# EAGLE design SwitchDemoESeries (EAGLE 9.4.0)
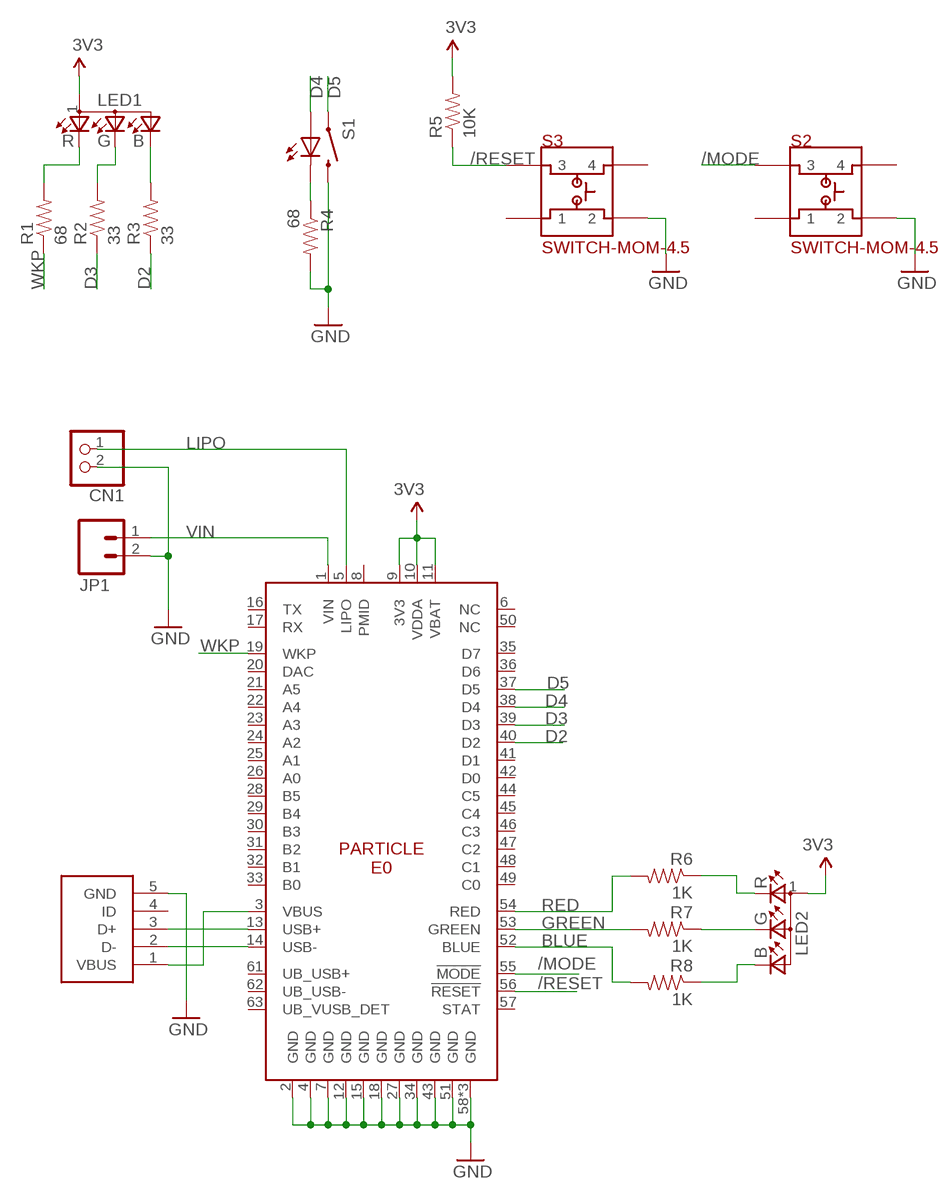
[diagram p0: schematic, sheet 1]

## Parts
CN1  JST_2PIN-THM  [JST-PH-2-THM]
JP1  M02PTH  [1X02]
LED1  LED-RGB-CREE-SMD  [LED-RGB-CREE-SMD]
LED2  LED-RGB-CREE-SMD  [LED-RGB-CREE-SMD]
R1  68  RES-68-0603.DEV  [0603-RES]
R2  33  RES-33-0603.DEV  [0603-RES]
R3  33  RES-33-0603.DEV  [0603-RES]
R4  68  RES-68-0603.DEV  [0603-RES]
R5  10K  RES-10K-06030603  [0603-RES]
R6  1K  RES-1K-0603  [0603-RES]
R7  1K  RES-1K-0603  [0603-RES]
R8  1K  RES-1K-0603  [0603-RES]
S1  SWITCH-MOMENTARY-LEDPTH  [TACTILE-PTH-LED-12MM]
S2  SWITCH-MOM-4.5  [SWITCH-MOM-4.5]
S3  SWITCH-MOM-4.5  [SWITCH-MOM-4.5]
U1  E0_V005  [E0]
U$3  USB-MICRO-B-SOCKET-AMPHENOL  [USB-B-SMT-AMPHENOL]

## Nets
3V3: LED1.1(A) LED2.1(A) R5.2 U1.9(3V3) U1.10(VDDA) U1.11(VBAT)
/MODE: S2.3 U1.55(!MODE)
/RESET: R5.1 S3.3 U1.56(!RESET)
BLED: LED1.2(B) R3.2
BLUE: R8.2 U1.52(BLUE)
D2: R3.1 U1.40(D2)
D3: R2.1 U1.39(D3)
D4: S1.A U1.38(D4)
D5: S1.4 U1.37(D5)
D+: U1.13(USB+) U$3.3(D+)
D-: U1.14(USB-) U$3.2(D-)
GLED: LED1.3(G) R2.2
GND: CN1.2 JP1.2 R4.2 S1.2 S2.2 S3.2 U1.2(GND) U1.4(GND) U1.7(GND) U1.12(GND) U1.15(GND) U1.18(GND) U1.27(GND) U1.34(GND) U1.43(GND) U1.51(GND) U1.58(GND) U1.59(GND) U1.60(GND) U$3.5(GND)
GREEN: R7.2 U1.53(GREEN)
LIPO: CN1.1 U1.5(LIPO)
N$2: LED2.3(G) R7.1
N$6: LED2.4(R) R6.1
N$10: LED2.2(B) R8.1
RED: R6.2 U1.54(RED)
RLED: LED1.4(R) R1.2
SLED: R4.1 S1.C
VBUS: U1.3(VBUS) U$3.1(VBUS)
VIN: JP1.1 U1.1(VIN)
WKP: R1.1 U1.19(WKP)
Unconnected: S2.1 S2.4 S3.1 S3.4 U1.6(NC) U1.8(PMID) U1.16(TX) U1.17(RX) U1.20(DAC) U1.21(A5) U1.22(A4) U1.23(A3) U1.24(A2) U1.25(A1) U1.26(A0) U1.28(B5) U1.29(B4) U1.30(B3) U1.31(B2) U1.32(B1) U1.33(B0) U1.35(D7) U1.36(D6) U1.41(D1) U1.42(D0) U1.44(C5) U1.45(C4) U1.46(C3) U1.47(C2) U1.48(C1) U1.49(C0) U1.50(NC) U1.57(STAT) U1.61(UB_USB+) U1.62(UB_USB-) U1.63(UB_VUSB_DET) U$3.4(ID)

## Library data of the parts
CN1 = rickk2:JST_2PIN: JST 2-Pin Connectors of various flavors SMT-RA (S2B-PH-SM4) 4UConnector #17311 SMT (B2B-PH-SM4) THM-RA (S2B-PH) THM (B2B-PH) 1=+ 2=- THM: CONN HEADER PH TOP 2POS 2MM $0.17 B2B-PH-K-S(LF)(SN) https://www.digikey.com/product-detail/en/jst-sales-america-inc/B2B-PH-K-S-LF-SN/455-1704-ND/926611
JP1 = rickk2:M02: Standard 2-pin 0.1" header. Use with - straight break away headers ( PRT-00116) - right angle break away headers (PRT-00553) - swiss pins (PRT-00743) - machine pins (PRT-00117) - female headers (PRT-00115) Molex polarized connector foot print use with: PRT-08233 with associated crimp pins and housings. 2.54_SCREWTERM for use with PRT-10571. 3.5mm Screw Terminal footprints for PRT-08084 5mm Screw Terminal footprints for use with PRT-08432
LED1 LED2 = rickk2:LED-RGB-CREE-SMD: LED RGB DIFFUSED 4SMD $ 0.35 Cree CLMVB-FKA-CFHEHLCBB7A363 2mm 4-PLCC common anode RGB LED https://www.digikey.com/product-detail/en/cree-inc/CLMVB-FKA-CFHEHLCBB7A363/CLMVB-FKA-CFHEHLCBB7A363CT-ND/6138627 Red=68 ohm, Green/Blue=33 ohm @ 3.3V
R1 R4 = rickk2:RES-68-0603.DEV: https://www.digikey.com/product-detail/en/panasonic-electronic-components/ERJ-3EKF68R0V/P68.0HCT-ND/1746805 Panasonic SMD 0603 1% 1/10W
R2 R3 = rickk2:RES-33-0603.DEV: https://www.digikey.com/product-detail/en/panasonic-electronic-components/ERJ-3EKF33R0V/P33.0HCT-ND/1746765 Panasonic SMD 0603 1% 1/10W
R5 = rickk2:RES-10K-0603: RES SMD 10K OHM 5% 1/4W 0603 $ 0.10 https://www.digikey.com/product-detail/en/panasonic-electronic-components/ERJ-PA3J103V/P10KBZCT-ND/5036237
R6-R8 = rickk2:RES-1K-0603: RES SMD 1K OHM 0.5% 1/5W 0603 $ 0.17 https://www.digikey.com/product-detail/en/panasonic-electronic-components/ERJ-PB3D1001V/P20283CT-ND/6214538 Panasonic
S1 = rickk2:SWITCH-MOMENTARY-LED: EZ is for Kits. There is no tStop (covering up the top side of the pads with mask). This helps the beginner see which side they should be soldering too. Red $2.10 https://www.sparkfun.com/products/10442 Also green, blue, and white Available in orange but I don't have that one
S2 S3 = rickk2:SWITCH-MOM-4.5: Manufacturer: E-Switch Manufacturer Part Number: TL3305AF160QG Description: SWITCH TACTILE SPST-NO 50MA 12V Detailed Description: Tactile Switch SPST-NO Top Actuated Surface Mount $0.20 https://www.digikey.com/product-detail/en/e-switch/TL3305AF160QG/EG5350CT-ND/5816195
U1 = Particle-Devices:E0: Particle’s E Series module platform is the World’s simplest solution for developing and deploying cellular-connected IoT products. Product Page : Datasheet <https://docs.particle.io/datasheets/electron-(cellular)/e-series-datasheet/> Github : Particle devices library <https://github.com/particle-iot/hardware-libraries/tree/master/Eagle>
U$3 = rickk2:USB-MICRO-B-SOCKET-AMPHENOL: CONN USB MICRO B RECPT SMT R/A $0.42 Amphenol FCI 10118194-0001LF https://www.digikey.com/products/en?keywords=609-4618-1-nd

## Board
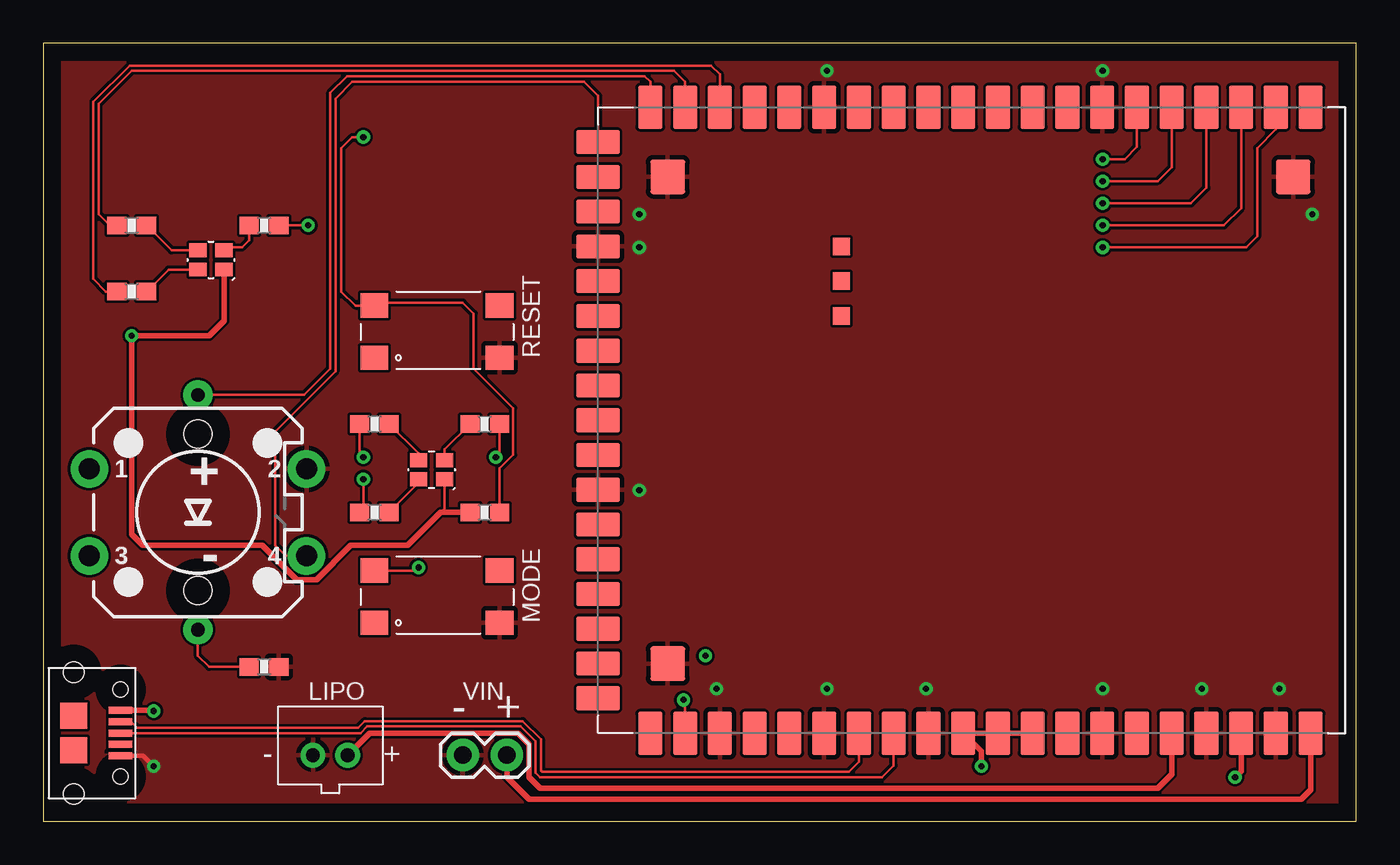
[diagram p1: board, top side]
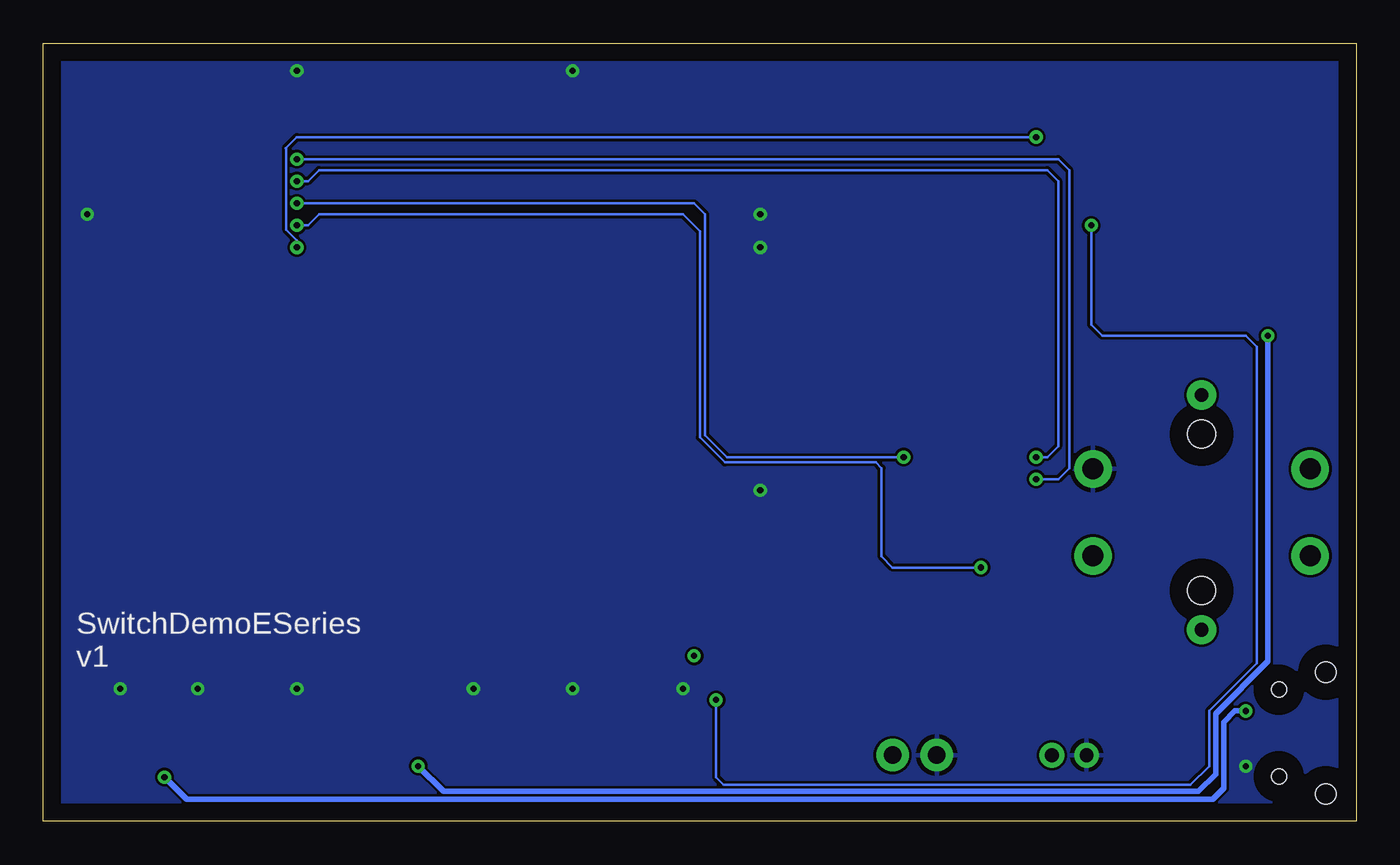
[diagram p2: board, bottom side, seen from below]

Size 75.55 x 44.76 mm. Coordinates in mm from the lower left corner, seen from the top.
Outline: 0,0 75.55,0 75.55,44.76 0,44.76 0,0
Copper layers (1*16): Top 0.035mm / dielectric 1.5mm / Bottom 0.035mm
Design rules "default": minimum track width 6mil, minimum drill 0.35mm, track to track 6mil, track to pad 6mil, pad to pad 6mil, via to via 6mil, smd to smd 6mil, copper to edge 40mil, drill to drill 6mil, minimum pad ring 10mil, minimum via ring 8mil, stop-mask expansion 4mil, vias tented up to drill 0mil, thermal gap 10mil

### Footprints (pad centres in the part's own frame; a part is rotated, then mirrored left to right if it is on the bottom)
JST-PH-2-THM = drill 0.8 pad 1.422: 1 1,0; 2 -1,0
1X02 = drill 1.016 pad 1.88: 1 0,0; 2 2.54,0
LED-RGB-CREE-SMD = smd 1 x 0.8: 1 1.5,0; 2 0,0; 3 0,1.1; 4 1.5,1.1
0603-RES = smd 1.1 x 1: 1 -0.85,0; 2 0.85,0
TACTILE-PTH-LED-12MM = drill 1.2 pad 2.159: 1 -6.25,2.5; 2 6.25,2.5; 3 -6.25,-2.5; 4 6.25,-2.5 | drill 0.8 pad 1.676: A 0,6.75; C 0,-6.75 | hole 1.6: 0,4.5; 0,-4.5
SWITCH-MOM-4.5 = smd 1.6 x 1.4: 1 0,0; 2 7.2,0; 3 0,3; 4 7.2,3
E0 = smd 2.5 x 1.4: 1 -0.008,2; 2 -0.008,4; 3 -0.008,6; 4 -0.008,8; 5 -0.008,10; 6 -0.008,12; 7 -0.008,14; 8 -0.008,16; 9 -0.008,18; 10 -0.008,20; 11 -0.008,22; 12 -0.008,24; 13 -0.008,26; 14 -0.008,28; 15 -0.008,30; 16 -0.008,32; 17 -0.008,34; 18 -0.008,36; 19 -0.008,38; 20 -0.008,40; 38 36.008,40; 39 36.008,38; 40 36.008,36; 41 36.008,34; 42 36.008,32; 43 36.008,30; 44 36.008,28; 45 36.008,26; 46 36.008,24; 47 36.008,22; 48 36.008,20; 49 36.008,18; 50 36.008,16; 51 36.008,14; 52 36.008,12; 53 36.008,10; 54 36.008,8; 55 36.008,6; 56 36.008,4; 57 36.008,2 | smd 1.4 x 2.5: 21 2,43.008; 22 4,43.008; 23 6,43.008; 24 8,43.008; 25 10,43.008; 26 12,43.008; 27 14,43.008; 28 16,43.008; 29 18,43.008; 30 20,43.008; 31 22,43.008; 32 24,43.008; 33 26,43.008; 34 28,43.008; 35 30,43.008; 36 32,43.008; 37 34,43.008 | smd 2 x 2: 58 32,3; 59 32,39; 60 4,39 | smd 1 x 1: 61 24,29; 62 26,29; 63 28,29
USB-B-SMT-AMPHENOL = smd 0.4 x 1.35: 1 -1.3,0; 2 -0.65,0; 3 0,0; 4 0.65,0; 5 1.3,0 | smd 1.5 x 1.55: P$6 -1,-2.7; P$7 1,-2.7 | hole 0.85: -2.5,0; 2.5,0 | hole 1.15: -3.5,-2.7; 3.5,-2.7

### Placement (x,y rotation side)
CN1  16.51,3.81 0 top
JP1  26.67,3.81 180 top
LED1  8.89,31.75 0 top
LED2  21.59,19.68 0 top
R1  12.7,34.29 180 top
R2  5.08,34.29 0 top
R3  5.08,30.48 0 top
R4  12.7,8.89 0 top
R5  25.4,17.78 180 top
R6  25.4,22.86 0 top
R7  19.05,22.86 180 top
R8  19.05,17.78 180 top
S1  8.89,17.78 0 top
S2  19.05,11.43 0 top
S3  19.05,26.67 0 top
U1  74.93,5.08 90 top
U$3  4.45,5.08 270 top

### Tracks (layer width: path | path; a pad name or v marks a point on that pad's centre or on a via)
3V3  (via drill 0.35)
  Top 0.152: LED2.1 23.09,18.01 22.86,17.78
  Top 0.305: v53.98,3.17 53.98,4.03 U1.11 U1.10 U1.9 | LED1.1 10.39,28.8 9.53,27.94 v5.08,27.94 5.08,16.51 5.71,15.88 12.59,15.88 14.57,13.9 15.71,13.9 17.69,15.88 20.95,15.88 22.86,17.78 R5.2
  Bottom 0.305: v53.98,3.17 52.53,1.73 9.07,1.73 8.08,2.72 8.08,6.2 5.08,9.2 v5.08,27.94
/MODE  (via drill 0.35)
  Top 0.152: S2.3 21.41,14.43 v21.59,14.61 | v60.96,34.29 67.94,34.29 68.93,35.27 U1.55
  Bottom 0.152: v60.96,34.29 60.33,34.29 59.69,34.92 38.73,34.92 37.77,33.96 37.77,22.1 36.32,20.65 27.64,20.65 27.3,20.32 27.3,15.24 26.67,14.61 v21.59,14.61
/RESET  (via drill 0.35)
  Top 0.152: v18.41,39.37 17.78,39.37 17.14,38.73 17.14,30.48 17.95,29.67 S3.3 19.23,29.84 24.13,29.84 24.77,29.21 24.77,26.04 27.03,23.77 27.03,21.09 26.25,20.31 R5.1 | v60.96,33.02 69.22,33.02 69.85,33.66 69.85,38.73 70.93,39.81 U1.56
  Bottom 0.152: v60.96,33.02 60.96,33.43 61.57,34.04 61.57,38.71 61.59,38.73 60.96,39.37 v18.41,39.37
BLED
  Top 0.152: LED1.2 7.2,31.75 R3.2
BLUE  (via drill 0.35)
  Top 0.152: v18.41,19.68 18.41,18 R8.2 | v60.96,38.1 62.23,38.1 62.93,38.8 U1.52
  Bottom 0.152: v60.96,38.1 17.14,38.1 16.51,37.47 16.51,20.32 17.14,19.68 v18.41,19.68
D2
  Top 0.152: 3.81,30.48 R3.1 3.6,30.48 2.87,31.2 2.87,41.4 4.95,43.48 38.43,43.48 38.93,42.98 U1.40
D3
  Top 0.152: U1.39 36.93,42.55 36.3,43.18 5.08,43.18 3.17,41.27 3.17,34.92 3.81,34.29 R2.1
D4
  Top 0.152: U1.38 34.93,42.54 34.59,42.88 17.48,42.88 16.51,41.91 16.51,26.04 15.01,24.53 S1.A
D5
  Top 0.152: S1.4 13.93,15.28 13.34,15.88 13.34,22.43 16.82,25.91 16.82,41.58 17.78,42.55 31.11,42.55 31.92,41.74 U1.37
D+
  Top 0.152: U$3.3 18.24,5.08 18.62,5.46 27.46,5.46 28.32,4.6 28.32,2.79 28.57,2.54 48.26,2.54 48.93,3.21 U1.13
D-
  Top 0.152: U$3.2 5.07,5.73 5.41,5.38 18.11,5.38 18.5,5.77 27.59,5.77 28.63,4.73 28.63,2.92 28.7,2.85 46.35,2.85 46.93,3.42 U1.14
GLED
  Top 0.152: LED1.3 7.37,32.85 R2.2
GND  (via drill 0.35)
  Top 0.254: U$3.5 5.75,3.78 v6.35,3.17
  other vias: 45.09,43.18 60.96,43.18 34.29,33.02 34.29,19.05 38.73,7.62 45.09,7.62 50.8,7.62 60.96,7.62 66.67,7.62 71.12,7.62 73.03,34.92 34.29,34.92
  pour Top: 0,0 0,48.26 78.74,48.26 78.74,0
  pour Bottom: 0,0 0,48.26 78.74,48.26 78.74,0
GREEN  (via drill 0.35)
  Top 0.152: v18.41,20.95 18.2,21.17 R7.2 | v60.96,36.83 64.14,36.83 64.93,37.62 U1.53
  Bottom 0.152: v60.96,36.83 60.33,36.83 59.69,37.47 17.78,37.47 17.14,36.83 17.14,21.59 17.78,20.95 v18.41,20.95
LIPO
  Top 0.305: CN1.1 18.78,5.08 27.3,5.08 27.94,4.45 27.94,2.54 28.57,1.91 64.14,1.91 64.93,2.7 U1.5
N$2
  Top 0.152: R7.1 21.59,21.17 LED2.3
N$3  (via drill 0.35)
  other vias: 38.1,9.53
N$6
  Top 0.152: LED2.4 23.09,21.4 R6.1
N$10
  Top 0.152: R8.1 21.59,19.47 LED2.2
RED  (via drill 0.35)
  Top 0.152: R6.2 26.25,21.17 v26.04,20.95 | v60.96,35.56 66.04,35.56 66.93,36.45 U1.54
  Bottom 0.152: v60.96,35.56 38.1,35.56 37.47,34.92 37.47,22.23 36.2,20.95 v26.04,20.95
RLED
  Top 0.152: LED1.4 10.56,33.02 11.43,33.02 11.85,33.44 R1.2
SLED
  Top 0.152: R4.1 9.53,8.89 8.89,9.53 S1.C
VBUS  (via drill 0.35)
  Top 0.305: U1.3 68.93,2.89 v68.58,2.54 | U$3.1 6.32,6.38 v6.35,6.35
  Bottom 0.305: v68.58,2.54 67.31,1.27 8.26,1.27 7.62,1.91 7.62,5.71 6.99,6.35 v6.35,6.35
VIN
  Top 0.305: JP1.1 26.67,2.54 27.94,1.27 72.39,1.27 72.93,1.81 U1.1
WKP  (via drill 0.35)
  Top 0.152: R1.1 v15.24,34.29 | v36.83,6.99 36.93,6.88 U1.19
  Bottom 0.152: v36.83,6.99 36.83,2.54 36.4,2.11 9.53,2.11 8.46,3.17 8.46,6.36 5.71,9.1 5.71,27.3 6.35,27.94 14.61,27.94 15.24,28.57 v15.24,34.29

### Text on the board
tPlace: RESET | MODE | LIPO | VIN | - | +
bPlace: SwitchDemoESeries / v1